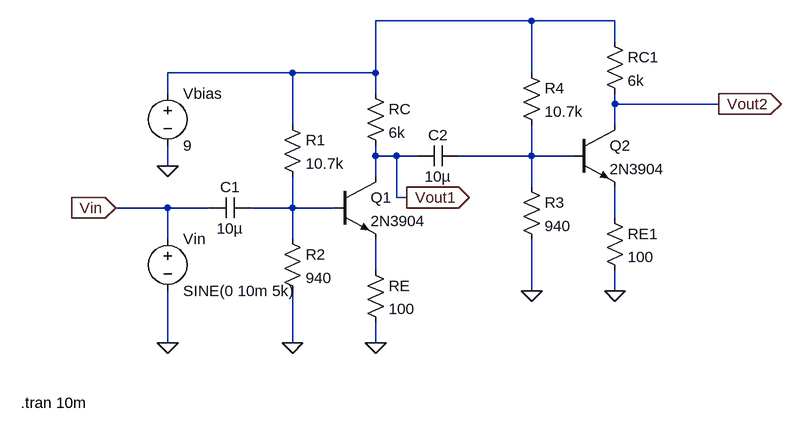
[diagram p0: schematic lab3p2.asc]
lab3p2.asc, the LTspice schematic file:
Version 4
SHEET 1 1468 680
WIRE 528 -144 288 -144
WIRE 656 -144 528 -144
WIRE 656 -112 656 -144
WIRE 160 -64 -32 -64
WIRE 288 -64 288 -144
WIRE 288 -64 160 -64
WIRE 528 -64 528 -144
WIRE -32 -32 -32 -64
WIRE 288 -32 288 -64
WIRE 656 -16 656 -32
WIRE 816 -16 656 -16
WIRE 160 16 160 -64
WIRE 656 16 656 -16
WIRE 288 64 288 48
WIRE 320 64 288 64
WIRE 352 64 320 64
WIRE 528 64 528 16
WIRE 528 64 416 64
WIRE 592 64 528 64
WIRE -32 80 -32 48
WIRE 288 96 288 64
WIRE 528 112 528 64
WIRE 320 128 320 64
WIRE 336 128 320 128
WIRE -32 144 -112 144
WIRE 32 144 -32 144
WIRE 160 144 160 96
WIRE 160 144 96 144
WIRE 224 144 160 144
WIRE 656 160 656 112
WIRE -32 192 -32 144
WIRE 160 192 160 144
WIRE 288 240 288 192
WIRE 528 272 528 192
WIRE 656 272 656 240
WIRE -32 352 -32 272
WIRE 160 352 160 272
WIRE 288 352 288 320
FLAG 288 352 0
FLAG 160 352 0
FLAG -32 352 0
FLAG -32 80 0
FLAG -112 144 Vin
IOPIN -112 144 In
FLAG 656 272 0
FLAG 528 272 0
FLAG 816 -16 Vout2
IOPIN 816 -16 Out
FLAG 336 128 Vout1
IOPIN 336 128 Out
SYMBOL cap 96 128 R90
WINDOW 0 0 32 VBottom 2
WINDOW 3 32 32 VTop 2
SYMATTR InstName C1
SYMATTR Value 10µ
SYMBOL cap 416 48 R90
WINDOW 0 0 32 VBottom 2
WINDOW 3 32 32 VTop 2
SYMATTR InstName C2
SYMATTR Value 10µ
SYMBOL res 144 176 R0
SYMATTR InstName R2
SYMATTR Value 940
SYMBOL res 144 0 R0
SYMATTR InstName R1
SYMATTR Value 10.7k
SYMBOL res 272 224 R0
SYMATTR InstName RE
SYMATTR Value 100
SYMBOL res 272 -48 R0
SYMATTR InstName RC
SYMATTR Value 6k
SYMBOL voltage -32 176 R0
WINDOW 123 0 0 Left 2
WINDOW 39 0 0 Left 2
SYMATTR InstName Vin
SYMATTR Value SINE(0 10m 5k)
SYMBOL voltage -32 -48 R0
WINDOW 123 0 0 Left 2
WINDOW 39 0 0 Left 2
SYMATTR InstName Vbias
SYMATTR Value 9
SYMBOL npn 224 96 R0
SYMATTR InstName Q1
SYMATTR Value 2N3904
SYMBOL res 512 96 R0
SYMATTR InstName R3
SYMATTR Value 940
SYMBOL res 512 -80 R0
SYMATTR InstName R4
SYMATTR Value 10.7k
SYMBOL res 640 144 R0
SYMATTR InstName RE1
SYMATTR Value 100
SYMBOL res 640 -128 R0
SYMATTR InstName RC1
SYMATTR Value 6k
SYMBOL npn 592 16 R0
SYMATTR InstName Q2
SYMATTR Value 2N3904
TEXT -258 444 Left 2 !.tran 10m

The netlist it stands for:
* lab3p2.asc
C1 N003 Vin 10µ
C2 N002 Vout1 10µ
R2 N003 0 940
R1 N001 N003 10.7k
RE N005 0 100
RC N001 Vout1 6k
Vin Vin 0 SINE(0 10m 5k)
Vbias N001 0 9
Q1 Vout1 N003 N005 0 2N3904
R3 N002 0 940
R4 N001 N002 10.7k
RE1 N004 0 100
RC1 N001 Vout2 6k
Q2 Vout2 N002 N004 0 2N3904
.model NPN NPN
.model PNP PNP
.lib standard.bjt
.tran 10m
.backanno
.end